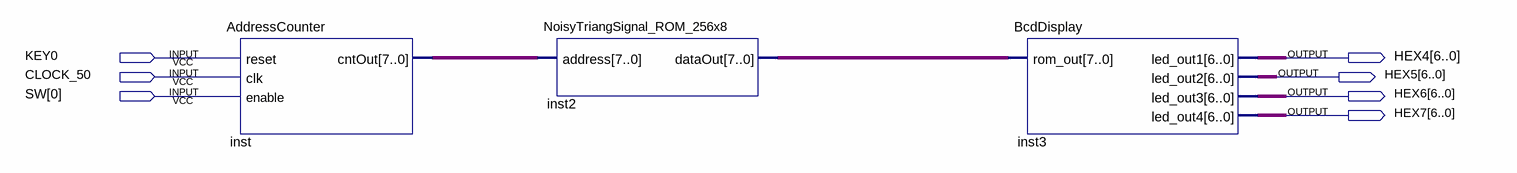
[diagram p0: schematic sheet]
// Quartus schematic TESTEdisplay.bdf as structural Verilog: 3 symbols, 7 pins
module TESTEdisplay (
  input  KEY0,
  input  CLOCK_50,
  input  [0:0] SW,
  output [6:0] HEX4,
  output [6:0] HEX5,
  output [6:0] HEX6,
  output [6:0] HEX7
);

  wire [7:0] inst2_dataout, inst_cntout;

  AddressCounter inst (.reset(KEY0), .clk(CLOCK_50), .enable(SW[0]), .cntOut(inst_cntout));
  NoisyTriangSignal_ROM_256x8 inst2 (.address(inst_cntout), .dataOut(inst2_dataout));
  BcdDisplay inst3 (.rom_out(inst2_dataout), .led_out1(HEX4), .led_out2(HEX5), .led_out3(HEX6), .led_out4(HEX7));
endmodule
